# EAGLE design Adafruit MagTag 2.9in Rev D (EAGLE 9.6.2)
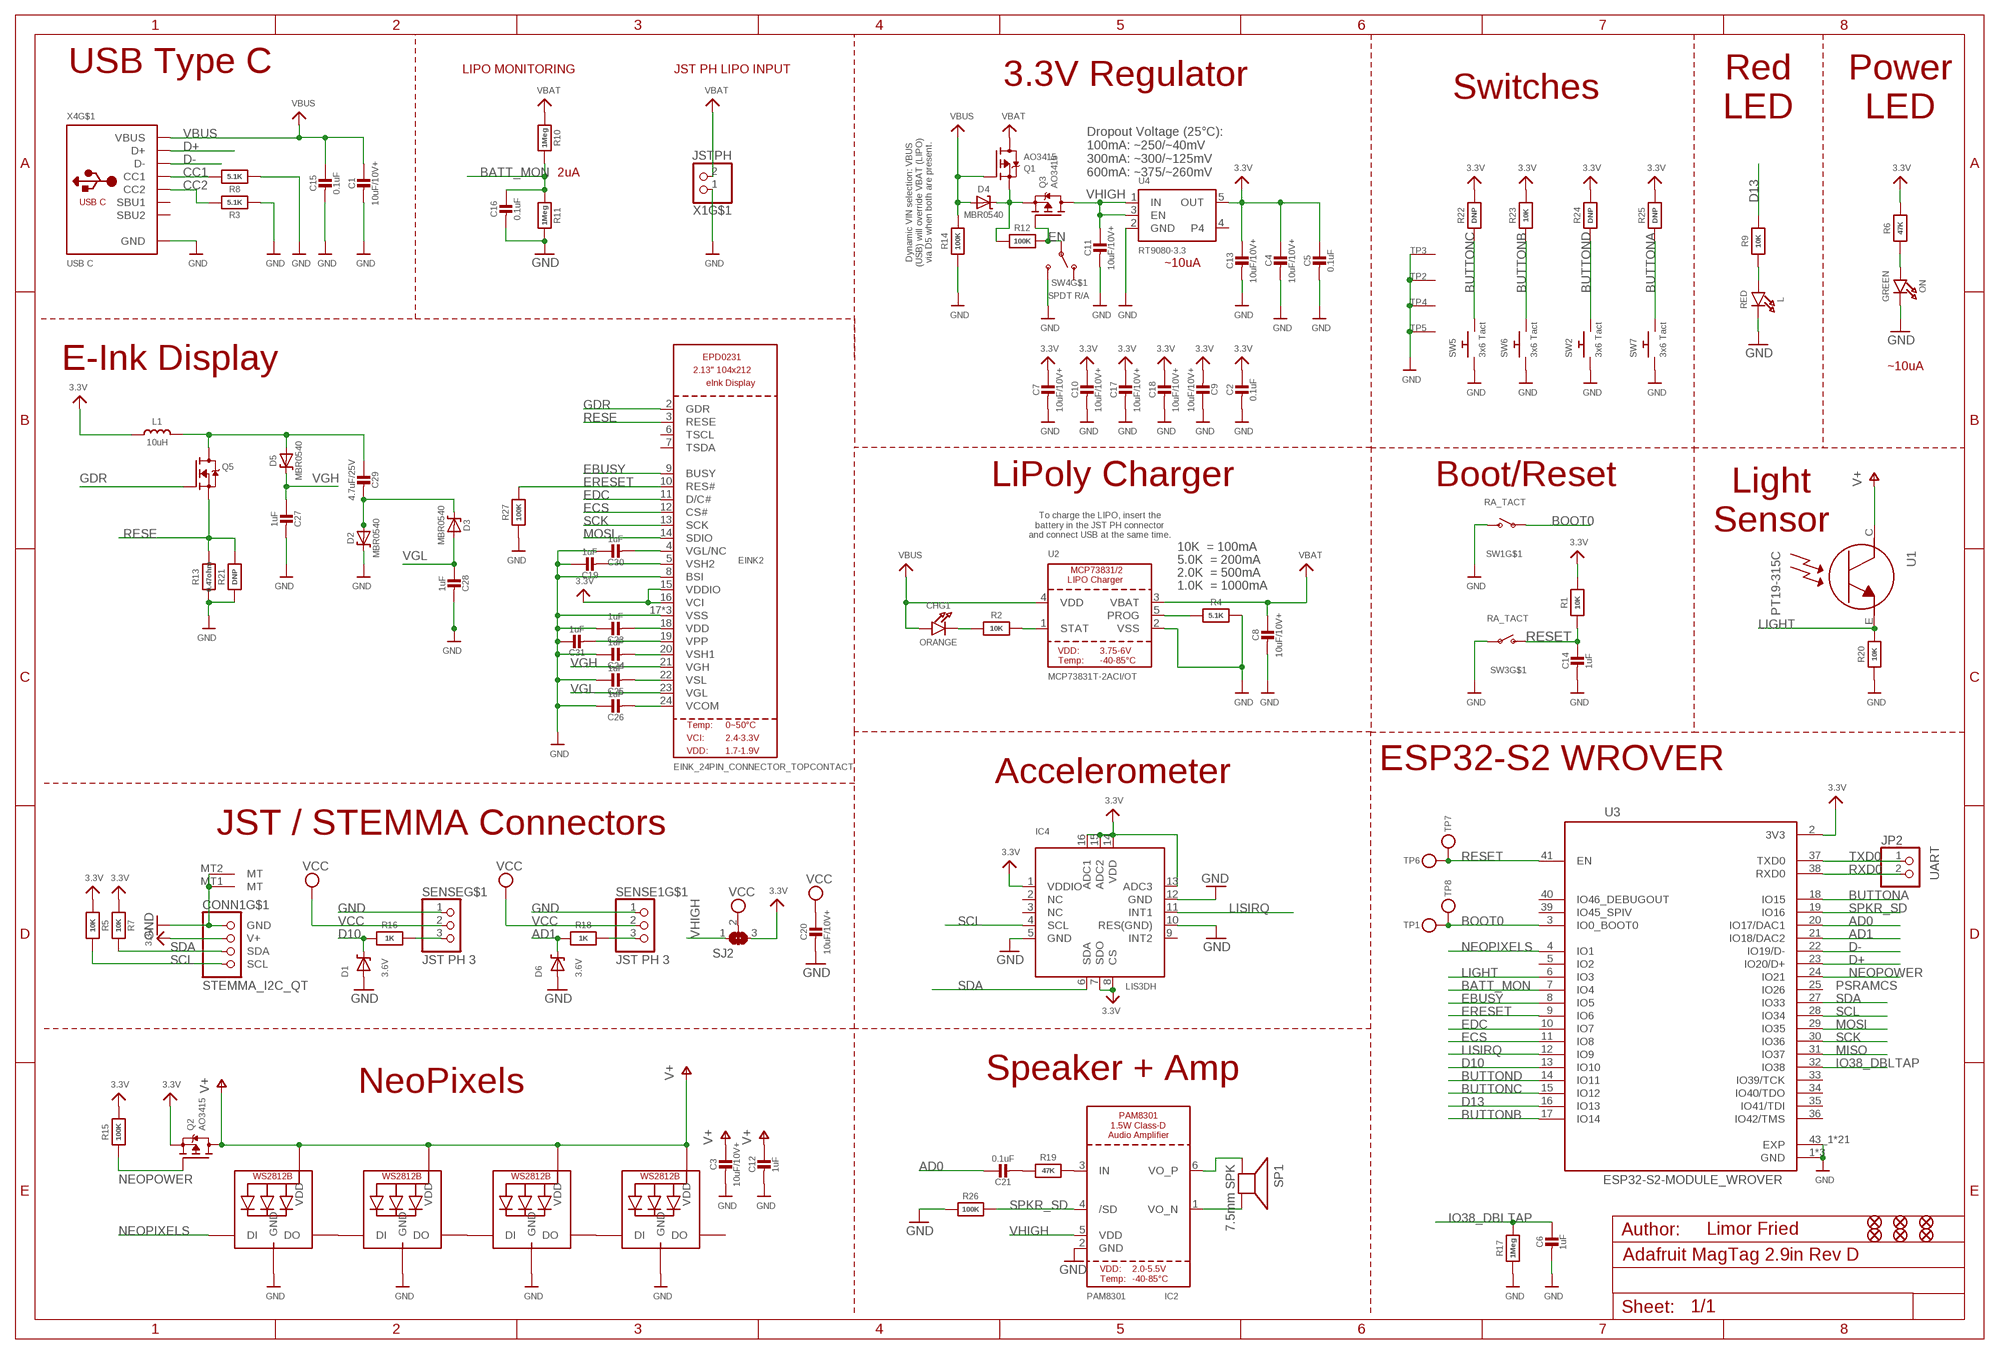
[diagram p0: schematic, sheet 1]

## Parts
C1  10uF/10V+  CAP_CERAMIC0805-NOOUTLINE  [0805-NO]
C2  0.1uF  CAP_CERAMIC0603_NO  [0603-NO]
C3  10uF/10V+  CAP_CERAMIC0805-NOOUTLINE  [0805-NO]
C4  10uF/10V+  CAP_CERAMIC0805-NOOUTLINE  [0805-NO]
C5  0.1uF  CAP_CERAMIC0603_NO  [0603-NO]
C6  1uF  CAP_CERAMIC0603_NO  [0603-NO]
C7  10uF/10V+  CAP_CERAMIC0805-NOOUTLINE  [0805-NO]
C8  10uF/10V+  CAP_CERAMIC0805-NOOUTLINE  [0805-NO]
C9  10uF/10V+  CAP_CERAMIC0805-NOOUTLINE  [0805-NO]
C10  10uF/10V+  CAP_CERAMIC0805-NOOUTLINE  [0805-NO]
C11  10uF/10V+  CAP_CERAMIC0805-NOOUTLINE  [0805-NO]
C12  1uF  CAP_CERAMIC0603_NO  [0603-NO]
C13  10uF/10V+  CAP_CERAMIC0805-NOOUTLINE  [0805-NO]
C14  1uF  CAP_CERAMIC0603_NO  [0603-NO]
C15  0.1uF  CAP_CERAMIC0603_NO  [0603-NO]
C16  0.1uF  CAP_CERAMIC0603_NO  [0603-NO]
C17  10uF/10V+  CAP_CERAMIC0805-NOOUTLINE  [0805-NO]
C18  10uF/10V+  CAP_CERAMIC0805-NOOUTLINE  [0805-NO]
C19  1uF  CAP_CERAMIC0805-NOOUTLINE  [0805-NO]
C20  10uF/10V+  CAP_CERAMIC0805-NOOUTLINE  [0805-NO]
C21  0.1uF  CAP_CERAMIC0603_NO  [0603-NO]
C23  1uF  CAP_CERAMIC0805-NOOUTLINE  [0805-NO]
C24  1uF  CAP_CERAMIC0805-NOOUTLINE  [0805-NO]
C25  1uF  CAP_CERAMIC0805-NOOUTLINE  [0805-NO]
C26  1uF  CAP_CERAMIC0805-NOOUTLINE  [0805-NO]
C27  1uF  CAP_CERAMIC0805-NOOUTLINE  [0805-NO]
C28  1uF  CAP_CERAMIC0805-NOOUTLINE  [0805-NO]
C29  4.7uF/25V  CAP_CERAMIC0805-NOOUTLINE  [0805-NO]
C30  1uF  CAP_CERAMIC0805-NOOUTLINE  [0805-NO]
C31  1uF  CAP_CERAMIC0805-NOOUTLINE  [0805-NO]
CHG1  ORANGE  LED0603_NOOUTLINE  [CHIPLED_0603_NOOUTLINE]
CONN1  STEMMA_I2C_QT  [JST_SH4]
D1  3.6V  DIODE-ZENERSOD323  [SOD-323]
D2  MBR0540  DIODE-SCHOTTKYSOD-123  [SOD-123]
D3  MBR0540  DIODE-SCHOTTKYSOD-123  [SOD-123]
D4  MBR0540  DIODE-SCHOTTKYSOD-123  [SOD-123]
D5  MBR0540  DIODE-SCHOTTKYSOD-123  [SOD-123]
D6  3.6V  DIODE-ZENERSOD323  [SOD-323]
EINK2  EINK_24PIN_CONNECTOR_TOPCONTACT  [EINK_24PIN_TOPCONTACT]
FID1  FIDUCIAL_1MM  [FIDUCIAL_1MM]
FID2  FIDUCIAL_1MM  [FIDUCIAL_1MM]
FID3  FIDUCIAL_1MM  [FIDUCIAL_1MM]
FID4  FIDUCIAL_1MM  [FIDUCIAL_1MM]
FID5  FIDUCIAL_1MM  [FIDUCIAL_1MM]
FID6  FIDUCIAL_1MM  [FIDUCIAL_1MM]
IC2  PAM8301  [SOT23-6]
IC4  LIS3DH  ACCEL_LIS3DHTR  [LGA16_3X3MM]
JP2  UART  HEADER-1X2ROUND  [1X02_ROUND]
L  RED  LED0603_NOOUTLINE  [CHIPLED_0603_NOOUTLINE]
L1  10uH  INDUCTORNR401  [INDUCTOR_4X4MM_NR401]
LED2  WS2812B_4020  [WS2812B_4020]
LED3  WS2812B_4020  [WS2812B_4020]
LED4  WS2812B_4020  [WS2812B_4020]
LED5  WS2812B_4020  [WS2812B_4020]
ON  GREEN  LED0603_NOOUTLINE  [CHIPLED_0603_NOOUTLINE]
Q1  AO3415  MOSFET-P  [SOT23-R]
Q2  AO3415  MOSFET-P  [SOT23-R]
Q3  AO3415  MOSFET-P  [SOT23-R]
Q5  IRLML0100  IRLML2060TRPBF  [SOT23-3]
R1  10K  RESISTOR_0603_NOOUT  [0603-NO]
R2  10K  RESISTOR_0603_NOOUT  [0603-NO]
R3  5.1K  RESISTOR_0603_NOOUT  [0603-NO]
R4  5.1K  RESISTOR_0603_NOOUT  [0603-NO]
R5  10K  RESISTOR_0603_NOOUT  [0603-NO]
R6  47K  RESISTOR_0603_NOOUT  [0603-NO]
R7  10K  RESISTOR_0603_NOOUT  [0603-NO]
R8  5.1K  RESISTOR_0603_NOOUT  [0603-NO]
R9  10K  RESISTOR_0603_NOOUT  [0603-NO]
R10  1Meg  RESISTOR_0603_NOOUT  [0603-NO]
R11  1Meg  RESISTOR_0603_NOOUT  [0603-NO]
R12  100K  RESISTOR_0603_NOOUT  [0603-NO]
R13  0.47ohm  RESISTOR0805_10MGAP  [0805_10MGAP]
R14  100K  RESISTOR_0603_NOOUT  [0603-NO]
R15  100K  RESISTOR_0603_NOOUT  [0603-NO]
R16  1K  RESISTOR_0603_NOOUT  [0603-NO]
R17  1Meg  RESISTOR_0603_NOOUT  [0603-NO]
R18  1K  RESISTOR_0603_NOOUT  [0603-NO]
R19  47K  RESISTOR_0603_NOOUT  [0603-NO]
R20  10K  RESISTOR_0603_NOOUT  [0603-NO]
R21  DNP  RESISTOR0805_10MGAP  [0805_10MGAP]
R22  DNP  RESISTOR_0603_NOOUT  [0603-NO]
R23  10K  RESISTOR_0603_NOOUT  [0603-NO]
R24  DNP  RESISTOR_0603_NOOUT  [0603-NO]
R25  DNP  RESISTOR_0603_NOOUT  [0603-NO]
R26  100K  RESISTOR_0603_NOOUT  [0603-NO]
R27  100K  RESISTOR_0603_NOOUT  [0603-NO]
SENSE  JST PH 3  CON_JST_PH_3PIN  [JSTPH3]
SENSE1  JST PH 3  CON_JST_PH_3PIN  [JSTPH3]
SJ2  SOLDERJUMPER_2WAY  [SOLDERJUMPER_2WAY_OPEN_NOPASTE]
SP1  7.5mm SPK  SPEAKER_7.5MM  [BUZZER_SMT_7.5MM]
SW1  RA_TACT  SWITCH_SPST_MNT_TACT_RA  [SPST_TACTILE_RA]
SW2  3x6 Tact  SWITCH_PUSHBUTTON_3.5X6MM  [TACTILE_3X6MM]
SW3  RA_TACT  SWITCH_SPST_MNT_TACT_RA  [SPST_TACTILE_RA]
SW4  SPDT R/A  SWITCH_SPDT  [SPDT_SMT_SSSS811101]
SW5  3x6 Tact  SWITCH_PUSHBUTTON_3.5X6MM  [TACTILE_3X6MM]
SW6  3x6 Tact  SWITCH_PUSHBUTTON_3.5X6MM  [TACTILE_3X6MM]
SW7  3x6 Tact  SWITCH_PUSHBUTTON_3.5X6MM  [TACTILE_3X6MM]
TP1  TESTPOINTROUND1.5MMNO  [TESTPOINT_ROUND_1.5MM_NO]
TP2  SEWTAP_SMTNUTM3  [SMT_NUT_3MM]
TP3  SEWTAP_SMTNUTM3  [SMT_NUT_3MM]
TP4  SEWTAP_SMTNUTM3  [SMT_NUT_3MM]
TP5  SEWTAP_SMTNUTM3  [SMT_NUT_3MM]
TP6  TESTPOINTROUND1.5MMNO  [TESTPOINT_ROUND_1.5MM_NO]
TP7  TESTPOINTROUND1.5MMNO  [TESTPOINT_ROUND_1.5MM_NO]
TP8  TESTPOINTROUND1.5MMNO  [TESTPOINT_ROUND_1.5MM_NO]
U1  PT19-315C  PHOTOTRANSISTOR_PT19-315C  [ALS-PT19-315C]
U2  MCP73831T-2ACI/OT  MCP73831/2  [SOT23-5]
U3  ESP32-S2-MODULE_WROVER  [MODULE_ESP32-S2-WROVER]
U4  RT9080-3.3  VREG_SOT23-5  [SOT23-5]
X1  JSTPH  CON_JST_PH_2PIN_MT_BATT  [JSTPH2_BATT]
X4  USB C  USB_C  [USB_C_CUSB31-CFM2AX-01-X]

## Nets
3.3V: C2.1 C4.1 C5.1 C7.1 C9.2 C10.1 C13.1 C17.1 C18.1 CONN1.2(V+) EINK2.15(VDDIO) EINK2.16(VCI) IC4.1(VDDIO) IC4.7(SDO) IC4.8(CS) IC4.13(ADC3) IC4.14(VDD) IC4.15(ADC2) IC4.16(ADC1) L1.P$2 Q2.2(S) R1.2 R5.1 R6.2 R7.1 R15.2 R22.2 R23.2 R24.2 R25.2 SJ2.3 U3.2(3V3) U4.5(OUT)
A1_JST1: R18.1 SENSE1.3
AD0: C21.1 U3.20(IO17/DAC1)
AD1: D6.C R18.2 U3.21(IO18/DAC2)
BATT_MON: C16.1 R10.2 R11.1 U3.7(IO4)
BOOT0: SW1.1(P) TP1.P$1 TP8.P$1 U3.3(IO0_BOOT0)
BUTTONA: R25.1 SW7.P$2 U3.18(IO15)
BUTTONB: R23.1 SW6.P$2 U3.17(IO14)
BUTTONC: R22.1 SW5.P$2 U3.15(IO12)
BUTTOND: R24.1 SW2.P$2 U3.14(IO11)
CC1: R8.2 X4.A5(CC1)
CC2: R3.2 X4.B5(CC2)
D10: D1.C R16.2 U3.13(IO10)
D10_JST: R16.1 SENSE.3
D13: R9.2 U3.16(IO13)
D+: U3.23(IO20/D+) X4.A6(D+) X4.B6(D+)
D-: U3.22(IO19/D-) X4.A7(D-) X4.B7(D-)
EBUSY: EINK2.9(BUSY) U3.8(IO5)
ECS: EINK2.12(CS#) U3.11(IO8)
EDC: EINK2.11(D/C#) U3.10(IO7)
EN: Q3.1(G) R12.2 SW4.B(P)
ERESET: EINK2.10(RES#) R27.2 U3.9(IO6)
GDR: EINK2.2(GDR) Q5.1(G)
GND [lowpower]: C1.2 C2.2 C3.2 C4.2 C5.2 C6.2 C7.2 C8.2 C9.1 C10.2 C11.2 C12.2 C13.2 C14.2 C15.2 C16.2 C17.2 C18.2 C19.1 C20.2 C23.1 C24.1 C25.1 C26.1 C27.2 C28.2 C30.1 C31.1 CONN1.1(GND) CONN1.MT1(MT) CONN1.MT2(MT) D1.A D2.C D6.A EINK2.8(BSI) EINK2.17(VSS) EINK2.SPRT1(VSS) EINK2.SPRT2(VSS) IC2.2(GND) IC4.5(GND) IC4.10(RES(GND)) IC4.12(GND) L.C LED2.4(GND) LED3.4(GND) LED4.4(GND) LED5.4(GND) ON.C R3.1 R4.2 R8.1 R11.2 R13.2 R14.1 R17.1 R20.1 R21.2 R26.1 R27.1 SENSE1.1 SENSE.1 SW1.2(S) SW2.P$1 SW3.1(P) SW4.C(S) SW5.P$1 SW6.P$1 SW7.P$1 TP2.P$1(SEW) TP3.P$1(SEW) TP4.P$1(SEW) TP5.P$1(SEW) U2.2(VSS) U3.1(GND) U3.26(GND) U3.42(GND) U3.43_1(EXP) U3.43_2(EXP) U3.43_3(EXP) U3.43_4(EXP) U3.43_5(EXP) U3.43_6(EXP) U3.43_7(EXP) U3.43_8(EXP) U3.43_9(EXP) U3.43_10(EXP) U3.43_11(EXP) U3.43_12(EXP) U3.43_13(EXP) U3.43_14(EXP) U3.43_15(EXP) U3.43_16(EXP) U3.43_17(EXP) U3.43_18(EXP) U3.43_19(EXP) U3.43_20(EXP) U3.43_21(EXP) U4.2(GND) X1.1 X4.A1B12(GND) X4.B1A12(GND)
IO38_DBLTAP: C6.1 R17.2 U3.32(IO38)
LIGHT: R20.2 U1.E U3.6(IO3)
LISIRQ: IC4.11(INT1) U3.12(IO9)
MISO: U3.31(IO37)
MOSI: EINK2.14(SDIO) U3.29(IO35)
N$1: L.A R9.1
N$2: LED2.3(DO) LED3.1(DI)
N$3: ON.A R6.1
N$4: CHG1.C R2.1
N$5: C21.2 R19.1
N$6: R2.2 U2.1(STAT)
N$8: IC2.3(IN) R19.2
N$9: R4.1 U2.5(PROG)
N$10: C19.2 EINK2.5(VSH2)
N$11: C23.2 EINK2.18(VDD)
N$12: C24.2 EINK2.20(VSH1)
N$13: LED4.3(DO) LED5.1(DI)
N$14: C29.2 D2.A D3.C
N$15: C29.1 D5.A L1.P$1 Q5.3(D)
N$16: C30.2 EINK2.4(VGL/NC)
N$17: C31.2 EINK2.19(VPP)
N$18: LED3.3(DO) LED4.1(DI)
N$19: IC2.1(VO_N) SP1.-
N$20: IC2.6(VO_P) SP1.+
N$21: D4.C Q1.2(S) Q3.2(S) R12.1
N$27: C25.2 EINK2.22(VSL)
N$33: C26.2 EINK2.24(VCOM)
NEOPIXELS: LED2.1(DI) U3.4(IO1)
NEOPOWER: Q2.1(G) R15.1 U3.24(IO21)
RESE: EINK2.3(RESE) Q5.2(S) R13.1 R21.1
RESET: C14.1 R1.1 SW3.2(S) TP6.P$1 TP7.P$1 U3.41(EN)
RXD0: JP2.2 U3.38(RXD0)
SCK: EINK2.13(SCK) U3.30(IO36)
SCL: CONN1.4(SCL) IC4.4(SCL) R5.2 U3.28(IO34)
SDA: CONN1.3(SDA) IC4.6(SDA) R7.2 U3.27(IO33)
SPKR_SD: IC2.4(/SD) R26.2 U3.19(IO16)
TXD0: JP2.1 U3.37(TXD0)
V+: C3.1 C12.1 LED2.2(VDD) LED3.2(VDD) LED4.2(VDD) LED5.2(VDD) Q2.3(D) U1.C
VBAT: C8.1 Q1.3(D) R10.1 U2.3(VBAT) X1.2
VBUS: C1.1 C15.1 CHG1.A D4.A Q1.1(G) R14.2 U2.4(VDD) X4.A4B9(VBUS) X4.B4A9(VBUS)
VCC [power]: C20.1 SENSE1.2 SENSE.2 SJ2.2
VGH: C27.1 D5.C EINK2.21(VGH)
VGL: C28.1 D3.A EINK2.23(VGL)
VHIGH: C11.1 IC2.5(VDD) Q3.3(D) SJ2.1 U4.1(IN) U4.3(EN)
Unconnected: EINK2.6(TSCL) EINK2.7(TSDA) IC4.2(NC) IC4.3(NC) IC4.9(INT2) LED5.3(DO) SENSE1.NC1(MT) SENSE1.NC2(MT) SENSE.NC1(MT) SENSE.NC2(MT) SW1.MT1(MT) SW1.MT2(MT) SW3.MT1(MT) SW3.MT2(MT) SW4.A(O) SW4.SUP1(MT) SW4.SUP2(MT) SW4.SUP3(MT) SW4.SUP4(MT) U3.5(IO2) U3.25(IO26) U3.33(IO39/TCK) U3.34(IO40/TDO) U3.35(IO41/TDI) U3.36(IO42/TMS) U3.39(IO45_SPIV) U3.40(IO46_DEBUGOUT) U4.4 X1.NC1 X1.NC2 X4.A8(SBU1) X4.B8(SBU2) X4.M1(MT) X4.M2(MT) X4.M3(MT) X4.M4(MT)

## Notes on the sheet
- USB Type C
- LIPO MONITORING | JST PH LIPO INPUT | 3.3V Regulator
- Switches
- Red
  LED
- Power
  LED
- 2uA
- Dropout Voltage (25°C):
  100mA: ~250/~40mV
  300mA: ~300/~125mV
  600mA: ~375/~260mV
- Dynamic VIN selection: VBUS
  (USB) will override VBAT (LIPO)
  via D5 when both are present.
- ~10uA
- E-Ink Display
- ~10uA
- LiPoly Charger | Boot/Reset
- Light
  Sensor
- To charge the LIPO, insert the
  battery in the JST PH connector
  and connect USB at the same time.
- 10K  = 100mA
- 5.0K  = 200mA
- 2.0K  = 500mA
- 1.0K  = 1000mA
- ESP32-S2 WROVER
- Accelerometer
- JST / STEMMA Connectors
- PSRAMCS
- Speaker + Amp
- NeoPixels
- Limor Fried

## Library data of the parts
C1-C21 C23-C31 = microbuilder:CAP_CERAMIC: Ceramic Capacitors For new designs, use the packages preceded by an '_' character since they are more reliable: The following footprints should be used on most boards: _0402 - Standard footprint for regular board layouts _0603 - Standard footprint for regular board layouts _0805 - Standard footprint for regular board layouts _1206 - Standard footprint for regular board layouts For extremely tight-pitch boards where space is at a premium, the following 'micro-pitch' footprints can be used (smaller pads, no silkscreen outline, etc.): _0402MP - Micro-pitch footprint for very dense/compact boards _0603MP - Micro-pitch footprint for very dense/compact boards _0805MP - Micro-pitch footprint for very dense/compact boards _1206MP - Micro-pitch footprint for very dense/compact boards
CHG1 L ON = microbuilder:LED: LED 0603 - 0603 Surface Mount Package 2mA: Green LED - Low Power (3.9mcd, 2ma, 1.7Vf) - Digikey: 475-2709-2-ND Orange LED - Low Power (9.8mcd, 2ma, 1.8Vf) - Digikey: 475-1194-2-ND Red LED - Low Power (5mcd, 2ma, 1.8Vf) - Digikey: 475-1195-2-ND Yellow LED - Low Power (7mcd, 2ma, 1.8Vf) - Digikey: 475-1196-2-ND 5mA: Blue LED - Low Power (17mcd, 5ma, 2.9Vf) - Digikey: LNJ937W8CRACT-ND 0805 - 0805 Surface Mount Package 2mA: Red LED (8.8mcd, 2mA, 1.8Vf, Clear) - Low Power [Digikey: 475-2510-1-ND] Green LED (5mcd, 2mA, 1.8Vf, Clear) - Low Power [Digikey: 475-2730-1-ND] Yellow LED (11.3mcd, 2mA, 1.8Vf, Clear) - Low Power [Digikey: 475-2555-1-ND] 20mA: Red LED (104mcd, 20mA, Diffused) - LS R976 [Digikey: 475-1278-6-ND] Red LED (12mcd, 20mA, 2.0Vf, Clear) - APT2012EC [Digikey: 754-1128-1-ND] Green LED (15mcd, 20mA, 2.2Vf, Clear) - APT2012GC [Digikey: 754-1131-1-ND] Orange LED (160mcd, 20mA, 2.1Vf, Clear) - APT2012SECK [Digikey: 754-1130-1-ND] 1206 - 1206 Surface Mount Package Green LED (26mcd, 20mA, Diffused) - LG N971 [Digikey: 475-1407-6-ND] Red LED (15mcd, 20mA, Diffused) - LH N974 [Digikey: 475-1416-6-ND] Cree - Cree High-Power Surface Mount LEDs XPEBWT-L1-0000-00D50 - White 111lm 350mA 2.9Vf 6200K 110° XTEAWT-00-0000-00000LEE3 - White 114lm 350mA 2.85Vf 5000K 115° Everlight - Everlight 45-21 Series Surface Mount LEDs 45-21/QK2C-B2832AC2CB2/2T - Warm White 2000mcd 20mA 3.25Vf 3050K 120° 45-21/LK2C-B38452C4CB2/2T - Nuetral White 2000mcd 20mA 3.25Vf 4150K 120° 45-21/LK2C-B50634C6CB2/2T - Cold White 2200mcd 20mA 3.25Vf 5650K 120° PLCC2 Reverse Mount LS T77K-J1L2-1-0-2-R18-Z - Red 11.25mcd 2mA 1.8Vf 630nm 120° LO T77K-L1M2-24-Z - Orange 19.6mcd 2mA 1.8Vf 606nm 120° LY T77K-K2M1-26-Z - Yellow 15.7mcd 2mA 1.8Vf 587nm 120°; ROT: 270
CONN1 = adafruit_electromech:STEMMA_I2C; LCSC: C2845363
D1 D6 = microbuilder:DIODE-ZENER: Zener Diode SMA: 30V 1W Zener Diode, 1.2Vf - Digikey: SMAZ30-FDICT-ND
D2-D5 = microbuilder:DIODE-SCHOTTKY
EINK2 = adafruit_display:EINK_24PIN
FID1-FID6 = microbuilder:FIDUCIAL: Fiducial Alignment Points Various fiducial points for machine vision alignment.; BOM: EXCLUDE
IC2 = microbuilder:PAM8301
IC4 = adafruit_sensor:ACCEL_LIS3DHTR: LIS3DHTR 3-Axis Accelerometer with I2C/SPI Interface VDD: 1.71-3.6V VDDIO: 1.71-VDD+0.1V Scale: +/-2g, 4g, 8g, 16g with 16--bit data output Temp:: -40°C - 85°C Mouser: 511-LIS3DHTR Digikey: 497-10613-1-ND
JP2 = microbuilder:HEADER-1X2: PIN HEADER
L1 = microbuilder:INDUCTOR: Inductors 0603: 10nH Ceramic Inductor - microwire antenna/RF (Digikey: 712-1434-2-ND) 0805: 560nH Ceramic Inductor - RF (Digikey: 553-1047-1-ND) 270nH Ceramic Inductor - Q = 40@250MHz, +-5%, 1 Ohm DC Resistance (Digikey: 535-10506-2-ND) 1007 (2518 Metric) SMT: 10µH 10% 250mOhm 820mA 1007 Inductor (Digikey: 587-2189-1-ND) 22µH 10% 500mOhm 580mA 1007 Inductor (Digikey: 587-2190-1-ND) 47µH 10% 950mOhm 420mA 1007 Inductor (Digikey: 587-2191-1-ND) 47µH 5% 100mOhm 1A 1008 Inductor (Digikey: 732-1816-1-ND) 5.0x5.0mm (Taiyo Yuden NR5040 Series) 6.8µH 20% 2.3A 64mOhm Inductor (Digikey: 587-2374-2-ND) 5.0x5.0mm (TDK VLC5045 Series) 4.7µH 20% 3.3A 34mOhm Inductor (Digikey: 445-6526-1-ND) 6.8µH 20% 2.7A 46mOhm Inductor (Digikey: 445-6527-1-ND) 6.0x6.0mm (TDK VLC6045 Series) 4.7µH 20% 3.8A 27mOhm Inductor (Digikey: 445-6538-2-ND) 6.8µH 20% 3A 41mOhm Inductor (Digikey: 445-6540-1-ND) 6.2µH 30% 2.2A 45mOhm Inductor (Digikey: SRR5028-6R2YCT-ND) - Not TDK VLC6045 but footprint should match 6.0x6.0mm (TDK SLF6045 Series) 6.8uH 30% 2A 33mOhm Inductor (Digikey: 445-4572-1-ND, Mouser: 810-SLF645T6R8N2R0PF) 6.0x6.0mm (Sumida CDRH5D28 Series) 6.2uH 30% 1.8A 45mOhm Inductor (Digikey: 308-1542-1-ND) Taiyo Yuden NR3015T2R2M - 2.2uH 20% 1.5A (Digikey: 587-1648-2-ND, Mouser: 963-NR3015T2R2M) - Used with TI TPS62172 CoilCraft RFID Transponder Coil - MA5532-AE (For use with AS3935 Lightning Sensor) Taiyo Yuden NRH2412T2R2MNGH - 2.2uH 20% 1AA (Digikey: 587-3443-1-ND) - Used with TI LM3671 Vishay IHLP 1.0uH Molded Inductor - 24mOhm DCR, 5A, +/-20%, -55°C-125°C (Digikey: 541-1319-1-ND)
LED2-LED5 = microbuilder:WS2812B
Q1-Q3 = microbuilder:MOSFET-P: P-Channel Mosfet LEGEND VDS: Voltage Drain-Source ID: Drain Current RDS(ON): Drain-Source On-State Resistance VGS(TH): Gate-Source Threshold Voltage CISS: Drain-Source Input Capacitance SOT-23 Name VDS ID RDS(ON) VGS(TH) CISS Order Number IRLML5103 30V 760mA 600 mOhm -- 75pF @ 25V Digikey: IRLML5103PBFCT-ND IRLML6401 12V 4.3A 50 mOhm 950mV @ 250µA 830pF @ 10V Digikey: IRLML6401PBFTR-ND NTR0202PL 20V 400mA 800 mOhm 2.3V @ 250uA 70pF @ 5V Digikey: NTR0202PLT1GOSTR-ND NTR4101PT1G 20V 1.8A 85 mOhm 1.2V @ 250uA 675pF @ 10V Digikey: NTR4101PT1GOSCT-ND DMP2004K 20V 600mA 900 mOhm 1V @ 250uA 175pF @ 16V Digikey: DMP2004KDICT-ND PMV65XP 20V 3.9A 76 mOhm 950mV @ 1mA 725pF @ 20V Digikey: 568-2358-2-ND TO-252 Name VDS ID RDS(ON) VGS(TH) CISS Order Number AOD417 30V 25A 34 mOhm 3V @ 250µA 920pF @ 15V Digikey: 785-1106-2-ND PowerPak Name VDS ID RDS(ON) VGS(TH) CISS Order Number AON7401 30V 12A 14 mOhm 3V @ 250µA 2600pF @ 15V Digikey: 785-1302-1-ND
Q5 = Parts:IRLML2060TRPBF
R1-R27 = microbuilder:RESISTOR: Resistors For new designs, use the packages preceded by an '_' character since they are more reliable: The following footprints should be used on most boards: _0402 - Standard footprint for regular board layouts _0603 - Standard footprint for regular board layouts _0805 - Standard footprint for regular board layouts _1206 - Standard footprint for regular board layouts For extremely tight-pitch boards where space is at a premium, the following 'micro-pitch' footprints can be used (smaller pads, no silkscreen outline, etc.): _0402MP - Micro-pitch footprint for very dense/compact boards _0603MP - Micro-pitch footprint for very dense/compact boards _0805MP - Micro-pitch footprint for very dense/compact boards _1206MP - Micro-pitch footprint for very dense/compact boards
SENSE SENSE1 = adafruit_electromech:CON_JST_PH_3PIN
SJ2 = microbuilder:SOLDERJUMPER_2WAY: 2-Way Solder Jumper
SP1 = microbuilder:SPEAKER: SPEAKER Source: Buerklin Added PS12 (for part # PS1240 piezo) http://www.ladyada.net/library/pcb/eaglelibrary.html; ROT: 180
SW1 SW3 = adafruit_electromech:SWITCH_SPST_MNT: Switch - SPST 4UCon 19192 (6.7x2.6mm SMT); LCSC: C778159
SW2 SW5-SW7 = adafruit_electromech:SWITCH_PUSHBUTTON: Buttons SOFTTOUCHSMD_SJ - Soft touch temporary push button (Super Junk Akihabara) Compatible with SKPMANE010 [Mouser: 688-SKPMAN] C&K_KSS = Digikey: KSS221GLFS
SW4 = adafruit_electromech:SWITCH_SPDT: Switch - SPDT SSSS811101 - Horizontal Two Position SMT, 0.3A 4V [Mouser: 688-SSSS811101]
TP1 TP6-TP8 = microbuilder:TESTPOINT: Test Point Various test points for characterisation and PCB testing TESTPOINT_SMT - Compact Surface Mount Test Point [Digikey: 5016KTR-ND]
TP2-TP5 = adafruit_electromech:SEWTAP; FORCETHM: 1
U1 = microbuilder:PHOTOTRANSISTOR: ALS-PT19-315C - Analog Light Sensor VCC: 2.5-5.5V; LCSC: C146233
U2 = microbuilder:MCP73831/2: MCP73831/2 LIPO Charger VDD: 3.75 - 6V Temp -40 - 85°C Programmable Charge Rate: 15-500mA NOTE: STAT is a tri-state logic output on the MCP73831 and an open-drain output on the MCP73832. SOT23-5 with 4.2V output and tri-state logic on STAT = MCP73831T-2ACI/OT; JLC_ROTATION: 0; LCSC: C424093
U3 = adafruit_wireless:ESP32-S2-MODULE: WiFi 802.11b/g/n Transceiver Module 2.4GHz Antenna Not Included Surface Mount Check prices <https://snapeda.com/parts/ESP32-S2-WROVER/Espressif%20Systems/view-part/?ref=eda>; AVAILABILITY: Warning; DESCRIPTION: WiFi 802.11b/g/n Transceiver Module 2.4GHz Antenna Not Included Surface Mount; DIGIKEY-PURCHASE-URL: https://snapeda.com/shop?store=DigiKey&id=4614060; MF: Espressif Systems; MP: ESP32-S2-WROVER; PACKAGE: VFQFN-56 Espressif Systems; PRICE: None
U4 = adafruit_power:VREG_SOT23-5: SOT23-5 Fixed Voltage Regulators Part Current Out V Out V In V Dropout θJA (°C/W) TJ (°C) Digikey Part No. ADP121 150mA 3.3V 3.4-5.5V 0.09V @ 150mA -- -- ADP121-AUJZ33R7CT-ND ADP121 150mA 3.0V 3.1-5.5V 0.09V @ 150mA -- -- ADP121-AUJZ30R7CT-ND ADP122 300mA 3.3V 3.4-5.5V 0.085V @ 300mA -- -- ADP122AUJZ-3.3-R7CT-ND ADP1712 300mA 3.3V 3.5-5.5V 0.17V @ 300mA -- -- ADP1712AUJZ-3.3-R7TR-ND AP7311 (Low Cost) 150mA 3.3V 3.5-6V 0.15V @ 150mA -- -- AP7311-33WG-7DICT-ND LD39015M18R 150mA 1.8V 1.9V-5.5V 0.08V @ 100mA -- -- 497-6977-1-ND LP2985A-33DBVR 150mA 3.3V 3.3-16V 0.28V @ 150mA 206 150 296-18479-1-ND MCP1824T-3302E/OT 300mA 3.3V 3.5V-6V 0.2V @ 300mA -- -- MCP1824T-3302E/OTCT-ND MIC5205-2.5YM5 TR 150mA 2.5V 2.7-16V 0.165V @ 150mA -- -- 576-1257-2-ND MIC5205-3.0YM5 TR 150mA 3.0V 3.2V-16V 0.165V @ 150mA -- -- 576-1258-2-ND MIC5205-3.3YM5 TR 150mA 3.3V 3.5V-16V 0.165V @ 150mA -- -- 576-1259-2-ND TPS780330220 150mA 3.3V+2.2V 3.6-5.5V 250mV Max -- -- 296-23332-1-ND TDA3663/N1,135 100mA 3.3V 3.5-45V 0.18V @ 50mA -- -- 568-5343-1-ND Max operating temp can be calculated using θJA, TJ (max junction temperature), and power in watts. Set the "Maximum Ambient Temperature" until it reaches TJ ("Max Junction Temperature"), which is the absolute limit for safe use of the regulator: Heat Sink Temperature Calculator <http://www.daycounter.com/Calculators/Heat-Sink-Temperature-Calculator.phtml> For example, With 12V source into a 3.3V LP2985 and a 30mA load, we are dissipating (12V-3.3V) * 0.03A = 0.261W. With a θJA of 206 °C/W, a TJ of 150°C, and 261mW we can safely use the chip without a heat sink up to 75°C (=147.1°C Junction Temperature).; JLC_ROTATION: 0
X1 = adafruit_electromech:CON_JST_PH_2PIN_MT; LCSC: C47647
X4 = adafruit_electromech:USB_C: USB Type-C USB 2.0 Connector; LCSC: C165948

## Net classes
0 default: width 0.178 mm
1 power: width 0.254 mm
2 lowpower: width 0.305 mm, drill 0.483 mm

## Board
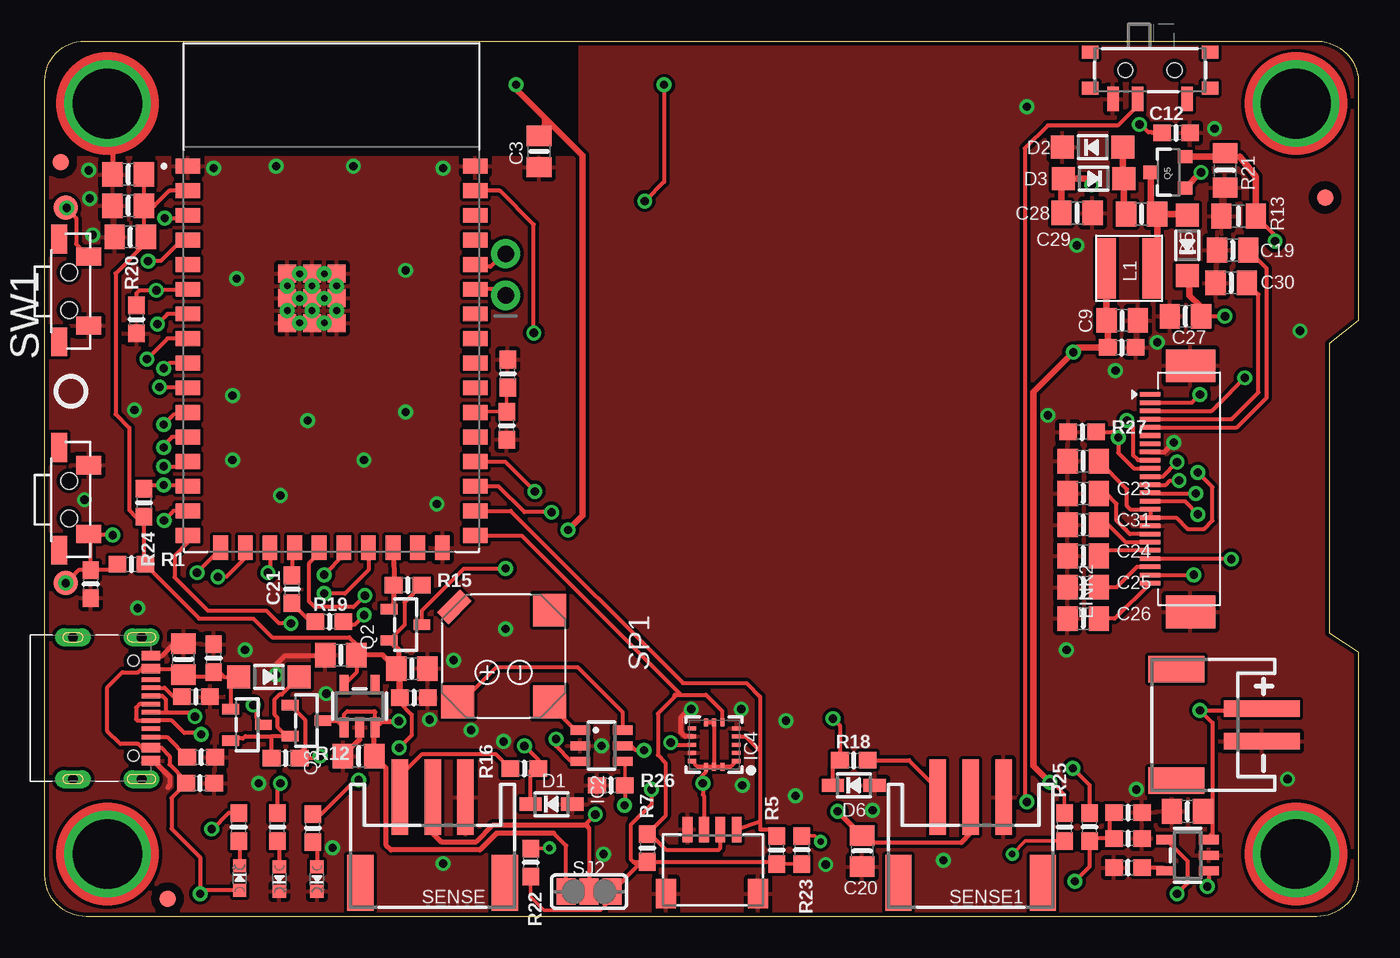
[diagram p1: board, top side]
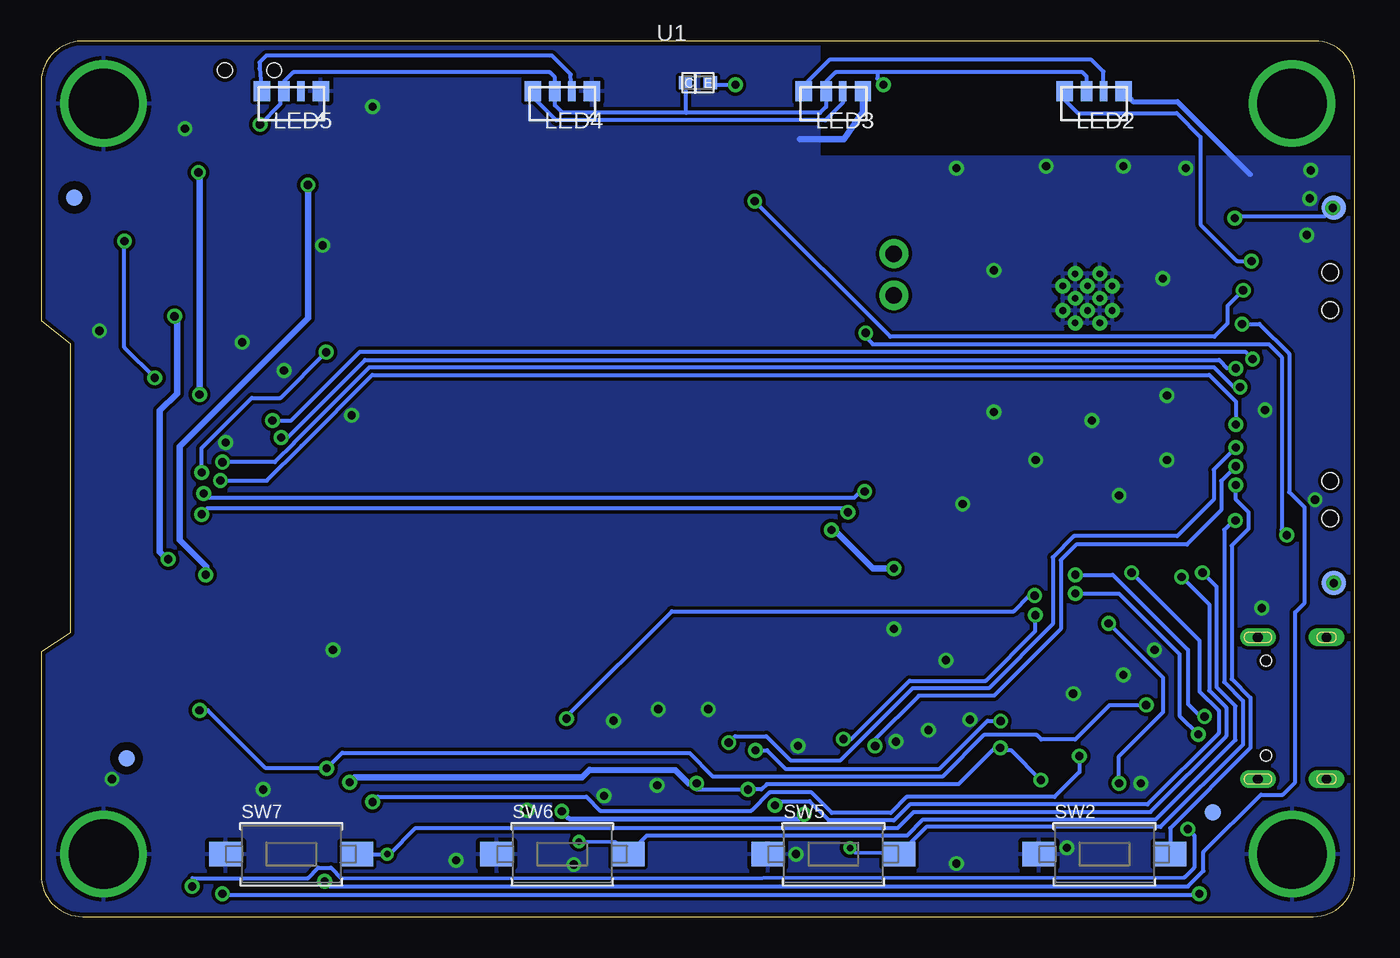
[diagram p2: board, bottom side, seen from below]

Size 80.01 x 53.34 mm. Coordinates in mm from the lower left corner, seen from the top.
Outline: 2.41,53.34 77.34,53.34 arc-90 80.01,50.93 80.01,36.32 78.23,34.92 78.23,17.27 80.01,16.13 80.01,2.54 arc-90 77.47,0 2.53,0 arc-90 0,2.53 0,50.93 arc-90 2.41,53.34
Copper layers (1*16): Top 0.035mm / dielectric 1.5mm / Bottom 0.035mm
Design rules "adafruit *": minimum track width 8mil, minimum drill 15.5mil, track to track 8mil, track to pad 8mil, pad to pad 8mil, via to via 8mil, smd to smd 8mil, copper to edge 10mil, drill to drill 8mil, minimum pad ring 10mil, minimum via ring 8mil, stop-mask expansion 2mil, vias tented up to drill 20mil, thermal gap 10mil

### Footprints (pad centres in the part's own frame; a part is rotated, then mirrored left to right if it is on the bottom)
0805-NO = smd 1.24 x 1.5: 1 -0.95,0; 2 0.95,0
0603-NO = smd 1.075 x 1: 1 -0.85,0; 2 0.85,0
CHIPLED_0603_NOOUTLINE = smd 0.8 x 0.8: A 0,-0.75; C 0,0.75
JST_SH4 = smd 0.6 x 1.55: 1 -1.5,2.006; 2 -0.5,2.006; 3 0.5,2.006; 4 1.5,2.006 | smd 1.2 x 1.8: MT1 -2.8,-1.894; MT2 2.8,-1.894
SOD-323 = smd 1.35 x 0.8: A 1.27,0; C -1.27,0
SOD-123 = smd 1.4 x 1.4: A 1.85,0; C -1.85,0
EINK_24PIN_TOPCONTACT = smd 0.275 x 1.25: 1 5.75,0.98; 2 5.25,0.98; 3 4.75,0.98; 4 4.25,0.98; 5 3.75,0.98; 6 3.25,0.98; 7 2.75,0.98; 8 2.25,0.98; 9 1.75,0.98; 10 1.25,0.98; 11 0.75,0.98; 12 0.25,0.98; 13 -0.25,0.98; 14 -0.75,0.98; 15 -1.25,0.98; 16 -1.75,0.98; 17 -2.25,0.98; 18 -2.75,0.98; 19 -3.25,0.98; 20 -3.75,0.98; 21 -4.25,0.98; 22 -4.75,0.98; 23 -5.25,0.98; 24 -5.75,0.98 | smd 2 x 3: SPRT1 7.5,-1.48; SPRT2 -7.5,-1.48
FIDUCIAL_1MM = smd 1 x 1: 1 0,0
SOT23-6 = smd 0.55 x 1.2: 1 -0.95,-1.3; 2 0,-1.3; 3 0.95,-1.3; 4 0.95,1.3; 5 0,1.3; 6 -0.95,1.3
LGA16_3X3MM = smd 0.5 x 0.25: 1 -1.35,1; 2 -1.35,0.5; 3 -1.35,0; 4 -1.35,-0.5; 5 -1.35,-1; 9 1.35,-1; 10 1.35,-0.5; 11 1.35,0; 12 1.35,0.5; 13 1.35,1 | smd 0.25 x 0.5: 6 -0.5,-1.35; 7 0,-1.35; 8 0.5,-1.35; 14 0.5,1.35; 15 0,1.35; 16 -0.5,1.35
1X02_ROUND = drill 1 pad 1.778: 1 -1.27,0; 2 1.27,0
INDUCTOR_4X4MM_NR401 = smd 1.2 x 3.7: P$1 -1.4,0; P$2 1.4,0
WS2812B_4020 = smd 1 x 1.2: 1 1.8,0.012; 4 -1.8,0.012 | smd 0.7 x 1.2: 2 0.45,0.012 | smd 0.45 x 1.2: 3 -0.575,0.012
SOT23-R = smd 0.635 x 1.016: 1 -0.95,-1; 2 0.95,-1; 3 0,1
SOT23-3 = smd 0.8 x 0.9: 1 -0.95,-1; 2 0.95,-1; 3 0,1.1
0805_10MGAP = smd 1.2 x 1.5: 1 -1.05,0; 2 1.05,0
JSTPH3 = smd 1 x 4.6: 1 -2,-2.7; 2 0,-2.7; 3 2,-2.7 | smd 1.6 x 3.4: NC1 -4.4,2.5; NC2 4.4,2.5
SOLDERJUMPER_2WAY_OPEN_NOPASTE = smd 1.168 x 1.6: 1 -1.397,0; 2 0,0; 3 1.397,0
BUZZER_SMT_7.5MM = smd 2 x 2: + 2.8,-2.8; - 2.8,2.8; MT2 -2.8,2.8 | smd 2 x 1 rotated 135: MT -3,-3
SPST_TACTILE_RA = smd 1.1 x 1.5: 1 2.1,-0.9; 2 -2.1,-0.9 | smd 1.75 x 1: MT1 3.175,0.9; MT2 -3.075,0.9 | hole 1: 1.15,0.3; -1.15,0.3
TACTILE_3X6MM = smd 2 x 1.5: P$1 -4,0; P$2 4,0
SPDT_SMT_SSSS811101 = smd 0.7 x 1.5: A -2.25,1.242; B 0.75,1.242; C 2.25,1.242 | smd 1 x 0.8: SUP1 -3.65,0.592; SUP2 -3.65,-1.608; SUP3 3.65,0.592; SUP4 3.65,-1.608 | hole 0.9: -1.5,-0.508; 1.5,-0.508
TESTPOINT_ROUND_1.5MM_NO = smd 1.5 x 1.5: P$1 0,0
SMT_NUT_3MM = drill 4.25 pad 4.572: P$1 0,0
ALS-PT19-315C = smd 0.8 x 0.8: C -0.75,0; E 0.75,0
SOT23-5 = smd 0.55 x 1.2: 1 -0.95,-1.3; 2 0,-1.3; 3 0.95,-1.3; 4 0.95,1.3; 5 -0.95,1.3
MODULE_ESP32-S2-WROVER = smd 1.5 x 0.9: 1 -8.75,11.683; 2 -8.75,10.183; 3 -8.75,8.683; 4 -8.75,7.183; 5 -8.75,5.683; 6 -8.75,4.183; 7 -8.75,2.683; 8 -8.75,1.183; 9 -8.75,-0.317; 10 -8.75,-1.817; 11 -8.75,-3.317; 12 -8.75,-4.817; 13 -8.75,-6.317; 14 -8.75,-7.817; 15 -8.75,-9.317; 16 -8.75,-10.817; 27 8.75,-10.817; 28 8.75,-9.317; 29 8.75,-7.817; 30 8.75,-6.317; 31 8.75,-4.817; 32 8.75,-3.317; 33 8.75,-1.817; 34 8.75,-0.317; 35 8.75,1.183; 36 8.75,2.683; 37 8.75,4.183; 38 8.75,5.683; 39 8.75,7.183; 40 8.75,8.683; 41 8.75,10.183; 42 8.75,11.683 | smd 0.9 x 1.5: 17 -6.75,-11.567; 18 -5.25,-11.567; 19 -3.75,-11.567; 20 -2.25,-11.567; 21 -0.75,-11.567; 22 0.75,-11.567; 23 2.25,-11.567; 24 3.75,-11.567; 25 5.25,-11.567; 26 6.75,-11.567 | smd 1.1 x 1.1: 43_1 -2.69,5.133; 43_2 -1.19,5.133; 43_3 0.31,5.133; 43_4 -2.69,3.633; 43_5 -1.19,3.633; 43_6 0.31,3.633; 43_7 -2.69,2.133; 43_8 -1.19,2.133; 43_9 0.31,2.133 | drill 0.4: 43_10 -1.94,5.133; 43_11 -0.44,5.133; 43_12 -2.69,4.383; 43_13 -1.19,4.383; 43_14 0.31,4.383; 43_15 -1.94,3.633; 43_16 -0.44,3.633; 43_17 -2.69,2.883; 43_18 -1.19,2.883; 43_19 0.31,2.883; 43_20 -1.94,2.133; 43_21 -0.44,2.133
JSTPH2_BATT = smd 1 x 4.6: 1 -1,-2.303; 2 1,-2.303 | smd 1.6 x 3.4: NC1 -3.4,2.897; NC2 3.4,2.897
USB_C_CUSB31-CFM2AX-01-X = smd 0.575 x 1.15: A1B12 -3.2,2.275; A4B9 -2.4,2.275; B1A12 3.2,2.275; B4A9 2.4,2.275 | smd 0.275 x 1.15: A5 -1.25,2.275; A6 -0.25,2.275; A7 0.25,2.275; A8 1.25,2.275; B5 1.75,2.275; B6 0.75,2.275; B7 -0.75,2.275; B8 -1.75,2.275 | drill 0.6 pad 1 long: M1 -4.32,1.7; M2 4.32,1.7; M3 -4.32,-2.48; M4 4.32,-2.48 | hole 0.65: 2.89,1.2; -2.89,1.2

### Placement (x,y rotation side)
C1  8.45,15.68 90 top
C2  65.6,34.67 0 top
C3  30.1,46.61 270 top
C4  22.35,15.11 0 top
C5  22.48,13.34 0 top
C6  28.19,33.08 90 top
C7  5.08,43.31 180 top
C8  69.6,6.41 180 top
C9  65.62,36.32 180 top
C10  5.08,45.21 180 top
C11  19.11,9.78 180 top
C12  68.9,47.75 0 top
C13  18.03,15.94 180 top
C14  2.79,20.26 270 top
C15  10.29,15.75 90 top
C16  65.98,4.76 0 top
C17  5.21,41.4 180 top
C18  63.25,27.75 180 top
C19  72.35,40.6 0 top
C20  49.78,4 270 top
C21  15.05,19.94 270 top
C23  63.25,25.78 0 top
C24  63.25,21.97 0 top
C25  63.25,20.07 0 top
C26  63.25,18.16 0 top
C27  69.47,36.58 180 top
C28  62.87,42.86 0 top
C29  66.8,42.8 180 top
C30  72.26,38.61 0 top
C31  63.25,23.88 0 top
CHG1  11.87,2.35 0 top
CONN1  40.64,3.3 0 top
D1  30.86,6.86 0 top
D2  63.82,46.86 0 top
D3  63.88,44.96 180 top
D4  13.65,14.61 180 top
D5  69.6,40.89 90 top
D6  49.28,8 0 top
EINK2  68.3,26.06 90 top
FID1  0.97,45.97 0 top
FID2  7.48,1.09 90 top
FID3  77.98,43.81 0 top
FID4  74.8,9.65 0 bottom
FID5  77.98,43.81 0 bottom
FID6  8.64,6.35 0 bottom
IC2  33.91,10.41 270 top
IC4  40.77,10.48 180 top
JP2  28.07,39.12 90 top
L  14.29,2.29 180 top
L1  66.04,39.5 180 top
LED2  15.88,50.29 180 bottom
LED3  31.75,50.29 180 bottom
LED4  48.26,50.29 180 bottom
LED5  64.77,50.29 180 bottom
ON  16.57,2.29 180 top
Q1  12.32,11.68 270 top
Q2  21.97,17.78 270 top
Q3  15.94,11.94 270 top
Q5  68.45,45.34 90 top
R1  5.27,21.46 0 top
R2  11.81,5.46 90 top
R3  9.53,9.72 180 top
R4  65.98,2.98 180 top
R5  44.58,4.06 90 top
R6  16.32,5.4 90 top
R7  36.7,4.19 90 top
R8  9.21,13.4 180 top
R9  14.16,5.46 90 top
R10  63.63,5.46 270 top
R11  65.98,6.35 0 top
R12  14.67,9.65 0 top
R13  72.71,42.67 180 top
R14  9.46,8.13 180 top
R15  22.1,20.19 0 top
R16  29.21,9.02 0 top
R17  28.13,29.91 90 top
R18  49.28,9.53 180 top
R19  17.34,17.97 0 top
R20  5.59,36.39 90 top
R21  71.88,45.47 270 top
R22  29.59,3.3 270 top
R23  46.1,4.06 270 top
R24  6.03,25.21 270 top
R25  62.1,5.46 90 top
R26  34.48,8 0 top
R27  63.18,29.53 0 top
SENSE  23.62,4.57 180 top
SENSE1  56.39,4.57 180 top
SJ2  33.15,1.52 0 top
SP1  27.94,15.88 270 top
SW1  1.78,38.1 90 top
SW2  15.24,3.81 0 bottom
SW3  1.78,25.4 90 top
SW4  67.31,51.05 180 top
SW5  31.75,3.81 0 bottom
SW6  48.26,3.81 0 bottom
SW7  64.77,3.81 0 bottom
TP1  1.27,43.18 270 top
TP2  3.81,49.53 0 top
TP3  3.81,3.81 0 top
TP4  76.2,49.53 0 top
TP5  76.2,3.81 0 top
TP6  1.27,20.32 0 top
TP7  1.27,20.32 0 bottom
TP8  1.27,43.18 0 bottom
U1  40.01,50.8 0 bottom
U2  69.6,3.75 90 top
U3  17.46,34.04 0 top
U4  19.18,12.83 0 top
U$15  [PCBFEAT-REV-040]  1.59,32 0 top
U$69  [MAGTAG_BOTTOM]  80.01,0 0 bottom
U$70  [MAGTAG_FRONT]  0,0 0 top
X1  71.82,11.68 90 top
X4  4.19,12.7 270 top

### Tracks (layer width: path | path; a pad name or v marks a point on that pad's centre or on a via)
3.3V  (via drill 0.5)
  Top 0.203: v61.21,8.19 61.37,8.19 62.1,7.45 R25.2 | R23.2 R5.1 | R22.2 29.59,1.21 30.42,0.38 33.85,0.38 34.54,1.08 SJ2.3
  Top 0.254: SJ2.3 36.11,3.09 35.85,3.34 | 35.85,3.34 R7.1 44.45,3.34 R5.1 | v36.96,7.75 36.96,6.86 35.69,5.59 35.69,3.51 35.85,3.34 | C18.1 65.91,26.03 65.91,25.02 66.16,24.78 67.29,24.78 EINK2.15 EINK2.16 68.91,24.31 69.6,23.62 70.61,23.62 71.12,24.13 71.12,26.16 v70.23,27.05 | C10.1 C7.1 | C7.1 6.03,41.53 C17.1 6.16,41.02 4.32,39.18 4.32,30.61 5.14,29.78 5.14,24.77 5.55,24.36 R24.2 6.03,21.55 R1.2 6.35,21.46 6.35,21.21 9.4,18.16 12.7,18.16 13.84,17.02 18.54,17.02 19.02,16.54 19.02,15.9 | C7.1 6.67,43.31 7.58,44.22 U3.2 | C13.1 19.02,15.9 | IC4.15 IC4.16 41.77,9.13 IC4.1 | IC4.15 IC4.14 | IC4.14 39.77,9.13 IC4.13 | IC4.15 IC4.7 IC4.8 | CONN1.2 40.14,7.37 40.08,7.43 v40.08,8.13 39.83,8.37 40.27,8.81 IC4.14 | L1.P$2 64.67,39.47 | C9.2 64.75,36.24 | v19.11,8.32 18.9,8.32 16.83,6.25 R6.2 | C5.1 21.63,13.02 22.35,12.29 22.35,11.05 v21.59,10.29 | R15.2 21.91,19.15 21.91,17.77 Q2.2 | U4.5 19.02,14.92 19.02,15.9
  Top 0.305: C13.1 20.58,15.94 C4.1 21.63,14.89 C5.1 21.54,13.42 21.54,16.26 Q2.2
  Top 0.406: 64.67,39.47 C9.2 | 64.75,36.24 C2.1 62.93,34.67 v62.64,34.38 60.22,31.97 60.22,9.18 v61.21,8.19
  Bottom 0.254: v19.11,8.32 20.95,10.16 21.46,10.16 v21.59,10.29 21.91,10.29 24.12,8.07 35.8,8.07 36.13,7.75 v36.96,7.75 40.08,7.75 v40.08,8.13 | v70.23,27.05 70.23,28.54 67.17,31.6 65.43,31.6 v62.64,34.38
  Bottom 0.406: v40.08,8.13 40.58,8.13 41.38,8.93 46.61,8.93 47.05,8.49 60.92,8.49 v61.21,8.19
A1_JST1
  Top 0.254: R18.1 52.64,9.53 54.13,8.03 54.13,7.53 SENSE1.3
AD0
  Top 0.254: U3.20 15.21,22.09 15.05,21.93 C21.1
AD1  (via drill 0.5)
  Top 0.254: D6.C 48.01,9.11 R18.2 48.43,11.64 v48.01,12.06 | U3.21 16.71,22.15 16.08,21.52 16.08,19.23 16.45,18.86 18.8,18.86 v19.49,19.56
  Bottom 0.254: v19.49,19.56 19.81,19.56 20.77,18.61 41.59,18.61 48.01,12.19 v48.01,12.06
BATT_MON  (via drill 0.5)
  Top 0.254: U3.7 7.47,36.72 v6.86,36.1 | C16.1 64.83,4.76 | 64.83,4.76 63.78,4.76 R10.2 63.63,3.05 v62.74,2.16 | R11.1 64.83,6.06 64.83,4.76
  Bottom 0.254: v6.86,36.1 5.8,36.1 3.99,34.29 3.99,25.87 3.05,24.93 3.05,19.11 3.62,18.54 3.62,8.19 4.38,7.43 5.71,7.43 9.21,3.94 9.21,2.79 10.16,1.84 62.42,1.84 v62.74,2.16
BOOT0  (via drill 0.5)
  Top 0.254: v1.33,43.18 TP8.P$1 1.91,42.55 1.91,40.97 SW1.1 | v7.31,42.55 8.71,42.55 U3.3
  Bottom 0.254: v7.31,42.55 7.18,42.67 1.84,42.67 1.43,43.09
  Bottom 0.406: TP8.P$1 v1.33,43.18 1.43,43.09
BUTTONA  (via drill 0.39, 0.5)
  Top 0.203: R25.1 59.73,4.61 v58.93,3.81
  Top 0.254: U3.18 12.21,21.86 11.05,20.7 v10.54,20.7
  Bottom 0.254: SW7.P$2 v58.93,3.81 58.8,3.81 57.2,5.41 27.82,5.41 26.86,6.38 12.43,6.38 7.82,10.98 7.82,12.74 8.87,13.78 8.87,19.02 v10.54,20.7
BUTTONB  (via drill 0.39, 0.5)
  Top 0.203: R23.1 46.9,4.91 v47.24,4.57
  Top 0.254: U3.17 10.68,22.37 v9.27,20.95
  Bottom 0.203: v47.24,4.57 45.02,4.57 SW6.P$2
  Bottom 0.254: SW6.P$2 43.12,4.95 27.25,4.95 26.29,5.92 12.12,5.92 7.26,10.77 7.26,12.83 8.41,13.97 8.41,20.09 v9.27,20.95
BUTTONC  (via drill 0.39, 0.5)
  Top 0.203: R22.1 30.7,4.15 v30.73,4.19
  Top 0.254: U3.15 7.85,24.72 v7.26,24.13
  Bottom 0.203: v30.73,4.19 30.45,3.9 27.65,3.9
  Bottom 0.254: SW5.P$2 27.65,3.9 26.1,5.46 11.82,5.46 6.81,10.48 6.81,13.15 7.95,14.29 7.95,23.56 7.38,24.13 v7.26,24.13
BUTTOND  (via drill 0.5)
  Top 0.254: U3.14 8.53,26.29 v7.24,26.29 6.26,26.29 R24.1
  Bottom 0.254: SW2.P$2 11.24,5.4 6.35,10.29 6.35,13.34 7.49,14.48 7.49,22.61 7.05,23.05 6.48,23.62 6.48,24.64 7.24,25.4 v7.24,26.29
CC1
  Top 0.254: X4.A5 7.3,13.95 7.85,13.4 R8.2
CC2
  Top 0.254: X4.B5 7.44,10.95 R3.2
D10  (via drill 0.5)
  Top 0.254: D1.C 29.59,8.93 R16.2 30.06,9.54 v29.21,10.39 | v7.24,27.43 8.71,27.43 U3.13
  Bottom 0.254: v7.24,27.43 8.13,26.54 8.13,24.77 10.22,22.67 16.95,22.67 17.91,21.72 17.91,17.53 21.97,13.46 26.54,13.46 29.21,10.79 v29.21,10.39
D10_JST
  Top 0.254: SENSE.3 21.62,8.54 22.99,9.91 27.45,9.91 28.34,9.02 R16.1
D13  (via drill 0.5)
  Top 0.254: U3.16 8.71,22.78 7.9,21.97 7.9,20.67 9.92,18.65 13.48,18.65 14.27,17.86 v14.99,17.86 | v14.35,8.13 14.16,7.94 R9.2
  Bottom 0.254: v14.99,17.86 11.68,14.56 11.68,12.45 14.35,9.78 v14.35,8.13
D+  (via drill 0.5)
  Top 0.254: v9.53,11.1 9.44,11.19 8.5,11.19 7.74,11.95 X4.B6 5.64,11.95 5.56,12.03 5.56,12.72 5.79,12.95 X4.A6 | U3.23 19.71,21.11 18.29,19.68 v17.02,19.68
  Bottom 0.254: v17.02,19.68 14.35,19.68 10.67,16 10.67,12.24 v9.53,11.1
D-  (via drill 0.5)
  Top 0.254: v9.14,12.19 8.89,12.45 7.49,12.45 | X4.A7 7.49,12.45 | U3.22 18.21,22.02 v17.02,20.83 | X4.B7 7.14,13.45 7.37,13.22 7.37,12.57 7.49,12.45
  Bottom 0.254: v17.02,20.83 14.73,20.83 10.16,16.26 10.16,12.95 9.4,12.19 v9.14,12.19
EBUSY  (via drill 0.5)
  Top 0.254: U3.8 7.47,35.22 v6.22,33.97 | v65.91,30.23 66.29,29.84 66.29,28.11 66.56,27.84 66.57,27.84 66.6,27.81 EINK2.9
  Bottom 0.254: v6.22,33.97 6.67,34.42 60.58,34.42 64.77,30.23 v65.91,30.23
ECS  (via drill 0.5)
  Top 0.254: v69.09,26.56 68.53,26.56 68.27,26.31 67.4,26.31 EINK2.12 | U3.11 7.84,30.58 v7.24,29.97
  Bottom 0.254: v69.09,26.56 66.26,26.56 64.14,28.68 59.83,32.99 8.87,32.99 7.24,31.37 v7.24,29.97
EDC  (via drill 0.5)
  Top 0.254: v6.99,32.26 8.62,32.26 U3.10 | EINK2.11 68.08,26.81 v68.96,27.69
  Bottom 0.254: v6.99,32.26 7.37,32.26 8.56,33.45 60.02,33.45 64.6,28.87 64.6,28.86 65.78,27.69 v68.96,27.69
EN  (via drill 0.5)
  Top 0.254: SW4.B 66.56,49.41 65.34,48.2 61.09,48.2 59.69,46.8 59.69,7.11 v59.82,6.99 | v16.76,9.78 16.64,9.65 R12.2 15.52,9.97 15.88,10.33 15.88,11.95 Q3.1
  Bottom 0.254: v59.82,6.99 59.5,7.3 46.8,7.3 45.95,6.45 36.74,6.45 35.63,7.57 33.08,7.57 31.84,6.33 28.26,6.33 27.29,7.29 18.29,7.29 16.76,8.81 v16.76,9.78
ERESET  (via drill 0.5)
  Top 0.254: U3.9 7.57,33.72 7.43,33.58 7.42,33.58 v7.24,33.4 | R27.2 65.05,29.53 v65.39,29.19 65.39,28.25 66.33,27.31 EINK2.10
  Bottom 0.254: v7.24,33.4 7.75,33.4 8.26,33.91 60.28,33.91 65,29.19 v65.39,29.19
GDR  (via drill 0.5)
  Top 0.254: 69.47,44.39 Q5.1 | EINK2.2 69.86,31.31 v70.36,31.81
  Top 0.406: v70.42,45.34 69.47,44.39
  Bottom 0.406: v70.42,45.34 70.36,45.28 v70.36,31.81
GND  (via drill 0.5)
  Top 0.305: C13.2 17.02,15.88 14.61,15.88 14.1,15.37 v14.1,14.73 | X4.B1A12 6.63,9.5 7.62,8.51 7.62,8 7.49,7.87 | X4.A1B12 7.14,15.9 7.87,16.63 C1.2 | IC4.10 39,10.98 38.73,11.24 38.73,12.13 39.24,12.64 v39.37,12.64 | C11.2 19.18,10.79 U4.2 | EINK2.8 68.19,28.31 v68.77,28.89 | TP2.P$1 4.13,49.21 C10.2
  Bottom 0.305: LED2.4 13.52,49.66 10.79,49.66 6.35,45.21
  Bottom 0.406: LED3.4 29.95,49.04 31.11,47.37 33.78,47.37
  other vias: 25.97,11.37 12.19,16.26 13.02,8.13 24.89,15.62 34.04,3.81 28.07,17.53 42.42,12.64 50.42,6.48 47.56,3.17 66.48,7.75 75.69,8.38 62.23,16.26 61.09,30.54 65.21,33.27 71.25,48.01 62.87,40.89 59.82,49.34 76.45,35.69 17.53,4.19 2.67,45.47 2.73,43.75 2.92,41.53 10.29,45.59 14.1,45.72 18.8,45.72 24.26,45.59 21.97,39.37 11.68,38.86 11.43,31.75 11.43,27.81 14.35,25.65 16,30.23 21.97,30.73 19.43,27.81 23.88,25.15 2.41,25.4 42.48,8 23.43,12 54.74,3.43 24.26,3.24 27.94,10.67 5.46,30.86 5.65,18.8 45.15,11.94 45.72,7.37 33.91,10.41 17.14,13.59 67.75,34.99
  pour Top: 0,46.23 32.64,46.23 32.64,53.21 79.88,53.21 79.88,0.13 0,0.13
  pour Bottom: -0.13,46.23 32.64,46.23 32.64,53.21 79.88,53.21 79.88,0.13 -0.13,0.13
IO38_DBLTAP
  Top 0.203: U3.32 26.29,30.76 R17.2 28.13,32.17 C6.1
LIGHT  (via drill 0.5)
  Top 0.254: U3.6 8.71,38.16 v6.79,38.16 5.78,38.16 5.59,37.97 R20.2 | v37.72,50.67 37.72,44.77 v36.54,43.59
  Bottom 0.254: v6.79,38.16 7.75,37.2 7.75,36.13 8.55,35.33 28.28,35.33 v36.54,43.59 | U1.E 39.13,50.67 v37.72,50.67
LISIRQ  (via drill 0.5)
  Top 0.254: U3.12 7.76,29.22 7.24,28.7 v7.24,28.57 | v38.12,10.6 38.35,10.6 38.48,10.48 IC4.11
  Bottom 0.254: v7.24,28.57 8.59,27.23 8.59,25.4 10.81,23.18 17.09,23.18 18.39,21.89 18.39,17.82 22.29,13.92 26.92,13.92 31.32,9.53 34.38,9.53 35.84,10.99 37.74,10.99 v38.12,10.6
MOSI  (via drill 0.5)
  Top 0.254: v30.86,24.64 29.21,24.64 27.63,26.22 U3.29 | EINK2.14 69.43,25.31 v70.23,24.51
  Bottom 0.254: v30.86,24.64 31.11,24.89 69.85,24.89 v70.23,24.51
N$1
  Top 0.254: L.A 14.29,4.48 R9.1
N$2
  Bottom 0.254: LED2.3 15.3,51.47 16.02,52.2 32,52.2 33.39,50.81 LED3.1
N$3
  Top 0.254: R6.1 16.57,4.29 ON.A
N$4
  Top 0.254: R2.1 11.87,4.55 CHG1.C
N$5
  Top 0.254: R19.1 16.17,17.97 C21.2
N$6  (via drill 0.5)
  Top 0.254: R2.2 11.2,6.31 10.19,5.3 v10.16,5.33 | U2.1 70.9,1.94 v70.8,1.84
  Bottom 0.254: v10.16,5.33 9.78,4.95 9.78,2.98 10.35,2.41 61.72,2.35 62.36,2.98 63.12,2.98 63.75,2.35 70.8,2.35 v70.8,1.84
N$7
  Top 0.254: 32.26,1.52 32.77,1.52
N$8  (via drill 0.5)
  Top 0.254: R19.2 18.38,17.78 18.86,17.78 v19.45,18.37 | IC2.3 32.06,9.46 31.14,10.39 v31.14,10.81
  Bottom 0.254: v31.14,10.81 30.67,10.81 27.11,14.38 22.48,14.38 19.45,17.4 v19.45,18.37
N$9
  Top 0.254: U2.5 68.11,2.98 R4.1
N$10
  Top 0.254: C19.2 74.42,39.48 74.42,31.62 72.71,29.91 72.61,29.81 EINK2.5
N$11
  Top 0.254: C23.2 64.64,25.78 65.28,25.15 65.28,24.13 65.85,23.56 66.1,23.31 EINK2.18
N$12
  Top 0.254: C24.2 64.48,22.26 64.5,22.28 64.53,22.31 EINK2.20
N$13
  Bottom 0.254: LED4.3 47.76,51.31 48.9,52.45 66.29,52.45 66.7,52.04 66.7,51.68 LED5.1
N$14
  Top 0.254: 65.67,45.02 D3.C | C29.2 65.73,42.92
  Top 0.406: D2.A 65.67,45.02 | D3.C 65.73,42.92
N$15
  Top 0.254: 67.75,39.81 L1.P$1 | C29.1 67.76,42.8 67.35,43.21 | 69.54,42.8 D5.A
  Top 0.406: C29.1 67.75,39.81 | 67.76,42.8 69.54,42.8 | Q5.3 67.35,43.21
N$16
  Top 0.254: C30.2 73.91,37.91 73.91,31.94 72.3,30.32 72.28,30.31 EINK2.4
N$17
  Top 0.254: C31.2 64.77,23.88 65.53,23.11 65.84,22.81 EINK2.19
N$18
  Bottom 0.254: LED3.3 31.18,49.58 32.24,48.51 48.64,48.51 49.99,49.86 LED4.1
N$19
  Top 0.254: SP1.- 30.74,12.94 32.32,11.36 IC2.1
N$20
  Top 0.254: IC2.6 35.21,12.44 32.48,15.18 27.5,15.18 25.39,13.07 SP1.+
N$21
  Top 0.254: Q1.2 11.45,10.86 12.08,10.86 12.21,10.99 13.82,10.99 | R12.1 13.82,10.99 | Q3.2 14.73,10.99 | 14.73,10.99 13.82,10.99 | D4.C 14.43,13.54 14.29,13.54 13.97,13.21 13.97,12.32 14.16,12.14 14.16,11.56 14.73,10.99
N$27
  Top 0.254: C25.2 65.28,20.07 66.52,21.31 EINK2.22
N$33
  Top 0.254: C26.2 64.39,18.16 65.17,18.16 EINK2.24
NEOPIXELS  (via drill 0.5)
  Top 0.254: U3.4 8.3,41.19 7.05,39.94 v6.29,39.94
  Bottom 0.254: v6.29,39.94 7.18,39.94 9.4,42.16 9.4,47.5 10.85,48.95 16.86,48.95 17.68,49.76 LED2.1
NEOPOWER
  Top 0.305: Q2.1 21.25,19.01 R15.1 21.25,20.13 21.32,20.13 U3.24
RESE  (via drill 0.5)
  Top 0.254: v73.09,32.83 71.44,31.18 71.07,30.81 EINK2.3 | v74.93,41.15 74.93,41.5 R13.1 | 72.78,46.29 71.88,46.29 R21.1
  Top 0.406: Q5.2 71.88,46.29 | R13.1 73.76,45.08 72.78,46.29
  Bottom 0.254: v73.09,32.83 74.93,34.67 v74.93,41.15
RESET  (via drill 0.5)
  Top 0.254: v29.78,35.56 29.78,42.16 27.73,44.22 U3.41 | C14.1 2.79,23.18 SW3.2 2.74,23.24 v4.13,23.24 | C14.1 2.06,21.11 TP7.P$1 | R1.1 4.06,21.11 C14.1
  Bottom 0.254: v29.78,35.56 29.78,35.31 29.35,34.87 5.22,34.87 4.45,34.1 4.45,23.56 v4.13,23.24
  other vias: 1.27,20.32
RXD0
  Top 0.254: U3.38 26.34,39.59 27.15,39.59 27.94,40.39 JP2.2
SCK  (via drill 0.5)
  Top 0.254: U3.30 28.03,27.72 v29.84,25.91 | v70.1,25.78 67.37,25.78 67.34,25.81 EINK2.13
  Bottom 0.254: v29.84,25.91 30.1,25.91 30.48,25.53 69.85,25.53 v70.1,25.78
SCL
  Top 0.254: U3.28 28.38,24.72 38.86,14.24 42.72,14.24 43.56,13.4 43.56,10.1 | CONN1.4 43.56,5.82 | R5.2 44.18,5.31 43.56,5.31 43.56,5.82 | IC4.4 42.68,10.98 43.56,10.1 | 43.56,10.1 43.56,5.82
SDA
  Top 0.254: CONN1.3 41.14,4.18 41.02,4.06 37.85,4.06 36.87,5.04 R7.2 37.8,6.14 37.8,9.38 37.34,9.84 37.34,12.38 38.35,13.4 38.35,13.53 38.73,13.53 | IC4.6 41.27,12.52 40.26,13.53 38.73,13.53 | U3.27 29.04,23.22 38.73,13.53
SPKR_SD  (via drill 0.5)
  Top 0.203: IC2.4 35.33,9.34 R26.2
  Top 0.254: U3.19 13.71,21.08 v13.59,20.95 | v35.31,6.78 35.36,6.83 35.21,6.99 35.33,7.11 R26.2
  Bottom 0.254: v13.59,20.95 9.45,16.82 9.45,13.72 8.28,12.55 8.28,11.17 12.62,6.83 27.1,6.83 28.07,5.87 32.03,5.87 33.2,7.04 35.05,7.04 v35.31,6.78
TXD0
  Top 0.254: JP2.1 27.69,38.22 U3.37
V+  (via drill 0.5)
  Top 0.254: v66.67,48.26 66.71,48.29 67.22,47.78 67.44,47.78 67.44,47.75 C12.1 | Q2.3 22.97,18.65 25.53,21.21 v28.07,21.21
  Top 0.406: 30.48,48.64 32.77,46.35 32.77,24.45 v31.88,23.56 | 30.48,48.64 28.7,50.42 v28.7,50.67 | C3.1 30.48,48.26 30.48,48.64
  Bottom 0.254: LED2.2 16.32,51.18 16.58,51.44 29.08,51.44 | 29.08,51.44 31.62,51.44 32.2,50.86 LED3.2 32.2,49.33 32.56,48.97 40.7,48.97 | 40.7,48.97 48.26,48.97 48.71,49.42 LED4.2 48.71,51.12 49.02,51.44 64.64,51.44 65.22,50.86 LED5.2 65.42,50.08 65.42,49.52 v66.67,48.26 | 29.08,51.44 29.08,51.05 v28.7,50.67 | U1.C 40.76,49.02 40.7,48.97
  Bottom 0.406: v28.07,21.21 29.34,21.21 31.69,23.56 v31.88,23.56
VBAT  (via drill 0.5)
  Top 0.254: X1.2 75.63,12.57 v70.36,12.57 71.12,11.81 71.12,6.35 | U2.3 70.74,4.7 71.12,5.08 71.12,6.35 | C8.1 71.06,6.41 71.12,6.35 | v12.7,12.89 12.87,12.72 12.87,12.13 Q1.3 | v62.61,9.04 63.63,8.02 R10.1
  Bottom 0.254: v12.7,12.89 14.92,12.89 17.02,10.79 19.09,10.79 19.36,11.07 22.59,11.07 25.12,8.53 39.07,8.53 40.51,9.97 61.66,9.99 v62.61,9.04 66.31,9.04 69.85,12.57 v70.36,12.57
VBUS  (via drill 0.5)
  Top 0.254: 8.29,14.89 8.08,15.1 X4.A4B9 6.41,15.16 5.96,15.16 5.68,14.88 4.72,14.88 3.81,13.97 3.81,11.3 4.6,10.52 5.68,10.52 5.96,10.24 5.96,10.3 X4.B4A9 7.07,10.3 7.6,9.78 7.6,9.27 8.61,8.26 R14.2 7.72,7.24 7.72,5.36 9.46,3.62 v9.46,1.4 9.66,1.6 CHG1.A | C1.1 8.57,14.61 10,14.61 C15.1 10.45,15.06 10.91,14.61 D4.A 11.32,14.12 Q1.1 | U2.4 69.6,3.4 69.6,2.03 v68.96,1.4
  Top 0.305: C1.1 8.29,14.89
  Bottom 0.254: v68.96,1.4 68.9,1.33 9.53,1.33 v9.46,1.4
VCC  (via drill 0.5)
  Top 0.254: v33.53,6.22 33.02,5.71 33.02,5.52 | 33.15,5.4 SJ2.2 | 49.75,4.95 C20.1 50.23,4.51 55.81,4.51
  Top 0.305: SENSE.2 23.62,5.08 24.13,4.57 26.29,4.57 27.3,5.59 32.96,5.59 33.02,5.52 33.15,5.4 | SENSE1.2 56.39,5.08 55.81,4.51 | 49.75,4.95 v48.29,6.41
  Bottom 0.305: v33.53,6.22 33.78,5.97 47.84,5.97 v48.29,6.41
VGH  (via drill 0.5)
  Top 0.254: D5.C 69.72,38.92 | 70.42,37.15 C27.1 v71.88,36.58 | EINK2.21 72.23,21.81 v72.26,21.78
  Top 0.406: 69.72,38.92 69.72,37.85 70.42,37.15
  Bottom 0.406: v71.88,36.58 71.71,36.41 71.71,31.88 72.77,30.82 72.77,22.23 72.32,21.78 v72.26,21.78
VGL  (via drill 0.5)
  Top 0.254: D3.A 61.91,44.84 | v69.98,20.83 69.92,20.78 69.89,20.81 EINK2.23
  Top 0.406: 61.91,44.84 C28.1 | v63.75,44.58 63.37,44.96 D3.A
  Bottom 0.406: v69.98,20.83 69.96,20.85 69.96,21.34 71.57,22.96 71.57,28.63 63.75,36.45 v63.75,44.58
VHIGH  (via drill 0.5)
  Top 0.254: SJ2.1 31.75,4.32 30.99,5.08 | v36.49,10.14 35.98,10.14 35.71,10.41 IC2.5 | U4.3 20.13,12.45 20.06,12.51 18.41,12.51 18.23,12.32 U4.1 17.82,11.94 Q3.3
  Top 0.305: 30.99,5.08 27.52,5.08 26.5,4.06 21.08,4.06 20.77,4.38 20.77,9.08 C11.1 20.06,11.46 U4.3 20.51,11.91 v21.56,11.91
  Bottom 0.254: v36.49,10.14 35.79,10.14 34.67,9.02 25.29,9.02 22.36,11.94 21.56,11.94 v21.56,11.91

### Text on the board
214bmp: D:/SmartProjects/Snc/a4_bn_logo2.bmp